# Altium schematic sheet FPGA Supply Pins.SchDoc
size A3; SheetNumber: 19; SheetTotal: 22
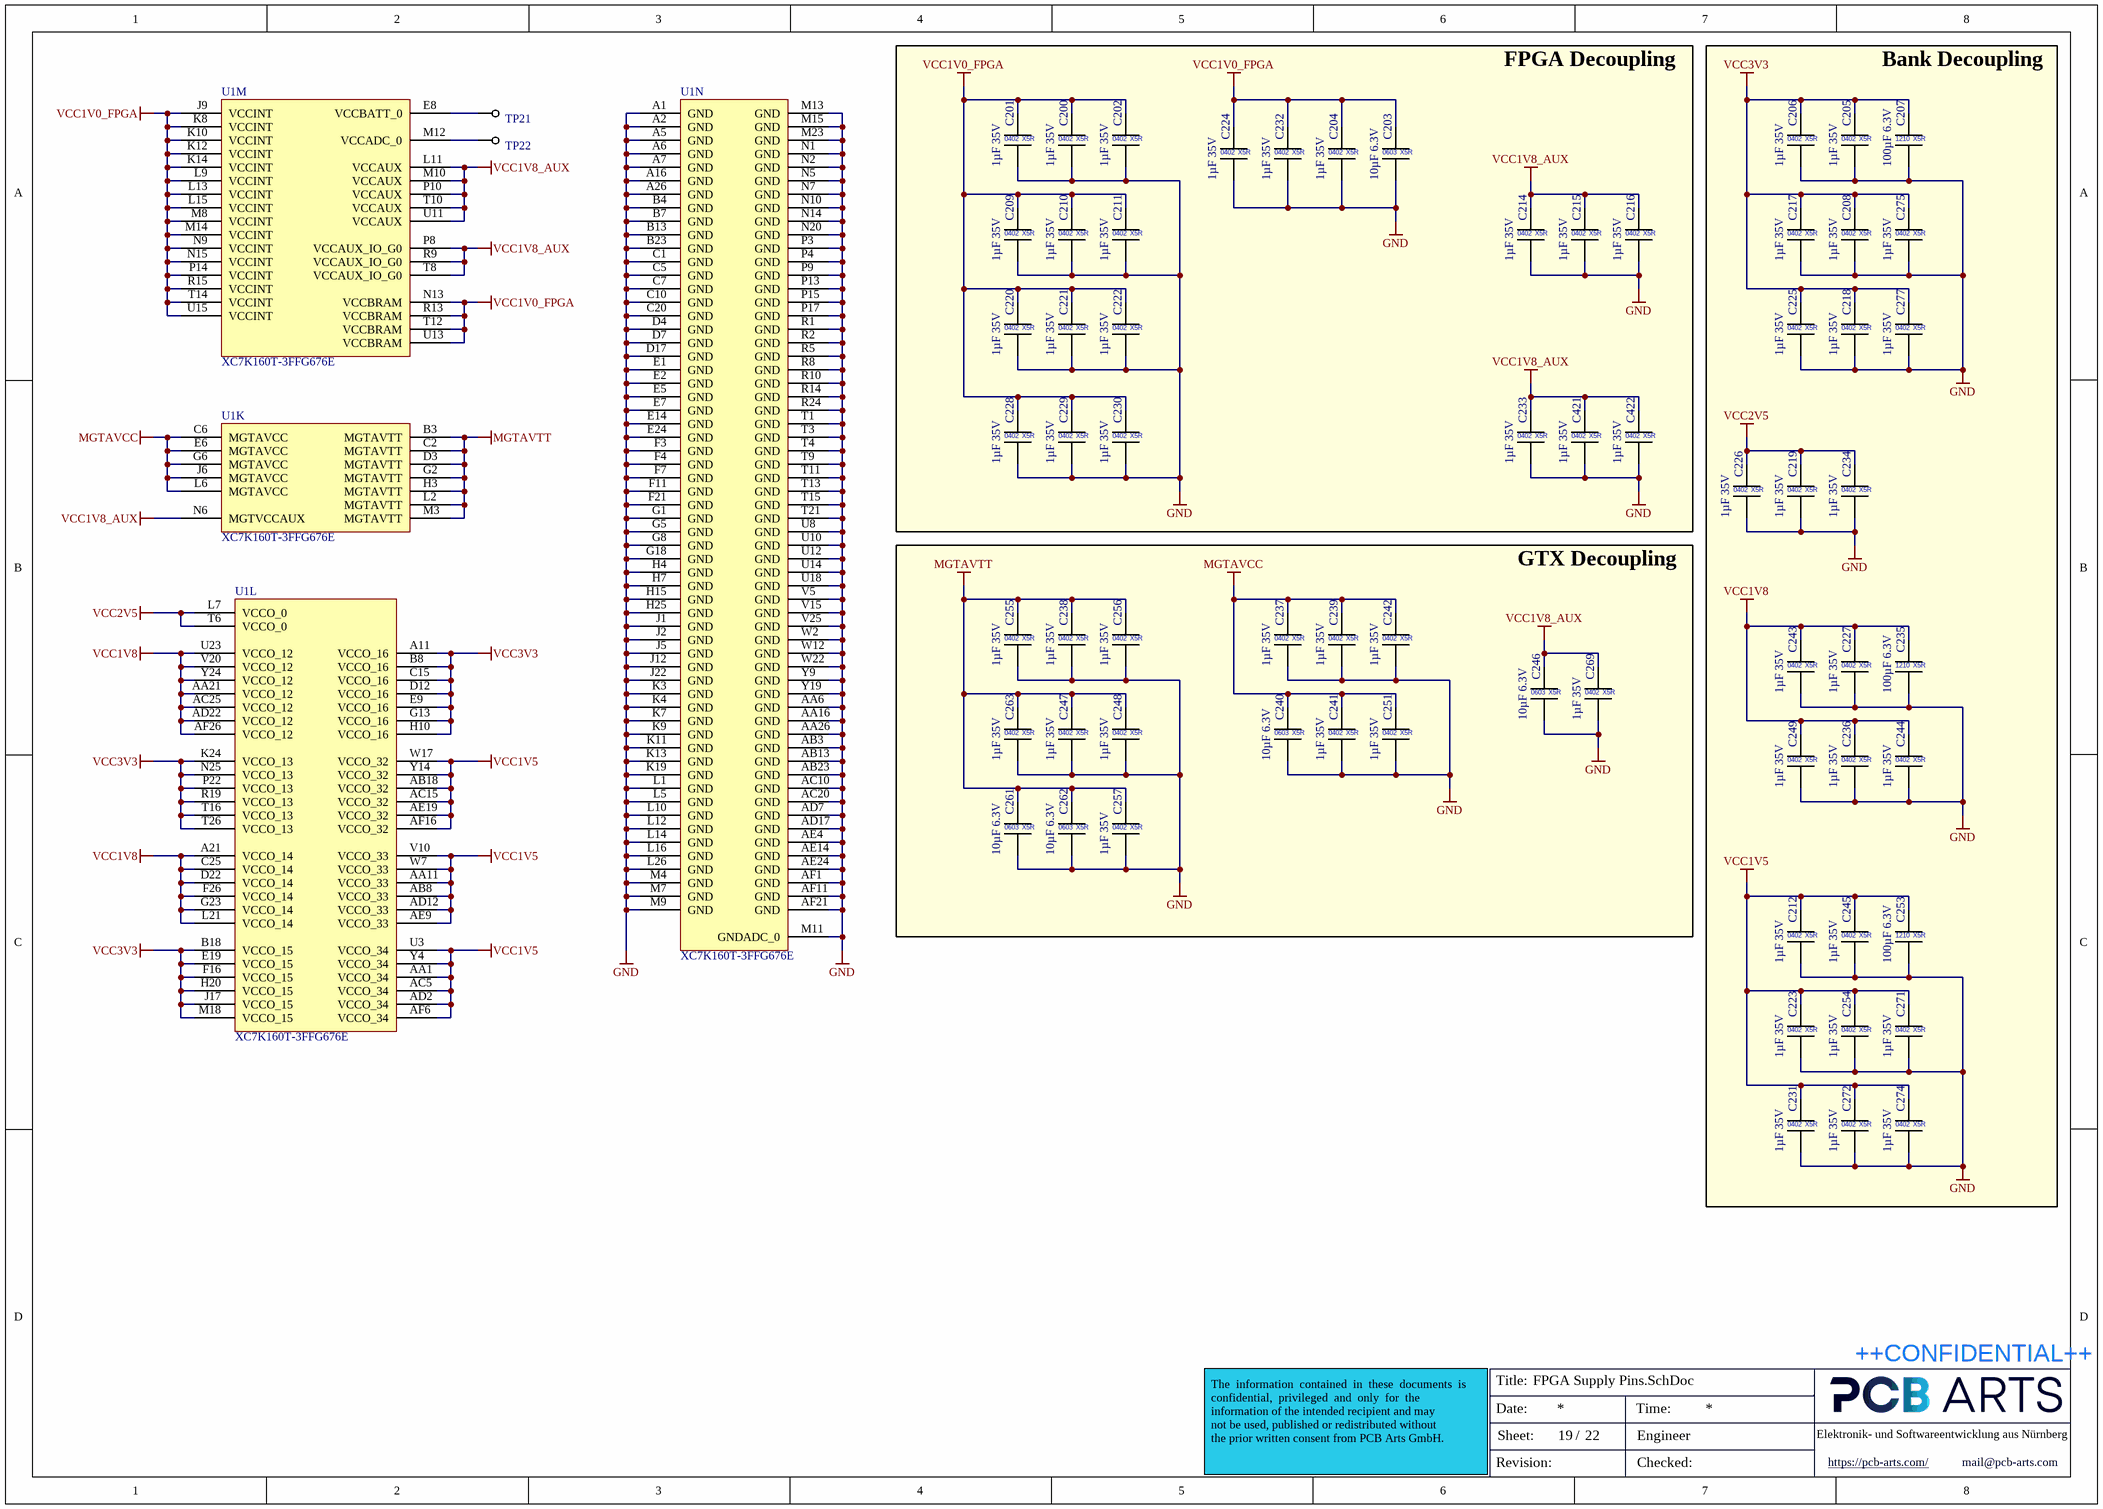
[diagram p0: FPGA Supply Pins.SchDoc]

## Parts
C200  1µF 35V  [CAP_0402_L]
C201  1µF 35V  [CAP_0402_L]
C202  1µF 35V  [CAP_0402_L]
C203  10µF 6.3V  [CAP_0603_L]
C204  1µF 35V  [CAP_0402_L]
C205  1µF 35V  [CAP_0402_L]
C206  1µF 35V  [CAP_0402_L]
C207  100µF 6.3V  [CAP_1210]
C208  1µF 35V  [CAP_0402_L]
C209  1µF 35V  [CAP_0402_L]
C210  1µF 35V  [CAP_0402_L]
C211  1µF 35V  [CAP_0402_L]
C212  1µF 35V  [CAP_0402_L]
C214  1µF 35V  [CAP_0402_L]
C215  1µF 35V  [CAP_0402_L]
C216  1µF 35V  [CAP_0402_L]
C217  1µF 35V  [CAP_0402_L]
C218  1µF 35V  [CAP_0402_L]
C219  1µF 35V  [CAP_0402_L]
C220  1µF 35V  [CAP_0402_L]
C221  1µF 35V  [CAP_0402_L]
C222  1µF 35V  [CAP_0402_L]
C223  1µF 35V  [CAP_0402_L]
C224  1µF 35V  [CAP_0402_L]
C225  1µF 35V  [CAP_0402_L]
C226  1µF 35V  [CAP_0402_L]
C227  1µF 35V  [CAP_0402_L]
C228  1µF 35V  [CAP_0402_L]
C229  1µF 35V  [CAP_0402_L]
C230  1µF 35V  [CAP_0402_L]
C231  1µF 35V  [CAP_0402_L]
C232  1µF 35V  [CAP_0402_L]
C233  1µF 35V  [CAP_0402_L]
C234  1µF 35V  [CAP_0402_L]
C235  100µF 6.3V  [CAP_1210]
C236  1µF 35V  [CAP_0402_L]
C237  1µF 35V  [CAP_0402_L]
C238  1µF 35V  [CAP_0402_L]
C239  1µF 35V  [CAP_0402_L]
C240  10µF 6.3V  [CAP_0603_L]
C241  1µF 35V  [CAP_0402_L]
C242  1µF 35V  [CAP_0402_L]
C243  1µF 35V  [CAP_0402_L]
C244  1µF 35V  [CAP_0402_L]
C245  1µF 35V  [CAP_0402_L]
C246  10µF 6.3V  [CAP_0603_L]
C247  1µF 35V  [CAP_0402_L]
C248  1µF 35V  [CAP_0402_L]
C249  1µF 35V  [CAP_0402_L]
C251  1µF 35V  [CAP_0402_L]
C253  100µF 6.3V  [CAP_1210]
C254  1µF 35V  [CAP_0402_L]
C255  1µF 35V  [CAP_0402_L]
C256  1µF 35V  [CAP_0402_L]
C257  1µF 35V  [CAP_0402_L]
C261  10µF 6.3V  [CAP_0603_L]
C262  10µF 6.3V  [CAP_0603_L]
C263  1µF 35V  [CAP_0402_L]
C269  1µF 35V  [CAP_0402_L]
C271  1µF 35V  [CAP_0402_L]
C272  1µF 35V  [CAP_0402_L]
C274  1µF 35V  [CAP_0402_L]
C275  1µF 35V  [CAP_0402_L]
C277  1µF 35V  [CAP_0402_L]
C421  1µF 35V  [CAP_0402_L]
C422  1µF 35V  [CAP_0402_L]
TP21  Testpoint  [Testpoint 0.8mm]  (value not drawn)  (no BOM)
TP22  Testpoint  [Testpoint 0.8mm]  (value not drawn)  (no BOM)
U1  XC7K160T-3FFG676E  [BGA100P2700X2700X317-676N]  (parts K,L,M,N of 14)

## Blocks framed on the sheet
FPGA Decoupling: C200-C204 C209-C211 C214-C216 C220-C222 C224 C228-C230 C232 C233 C421 C422
Bank Decoupling: C205-C208 C212 C217-C219 C223 C225-C227 C231 C234-C236 C243-C245 C249 C253 C254 C271 C272 C274 C275 C277
GTX Decoupling: C237-C242 C246-C248 C251 C255-C257 C261-C263 C269

## Nets
GND: C200.2 C201.2 C202.2 C203.2 C204.2 C205.2 C206.2 C207.2 C208.2 C209.2 C210.2 C211.2 C212.2 C214.2 C215.2 C216.2 C217.2 C218.2 C219.2 C220.2 C221.2 C222.2 C223.2 C224.2 C225.2 C226.2 C227.2 C228.2 C229.2 C230.2 C231.2 C232.2 C233.2 C234.2 C235.2 C236.2 C237.2 C238.2 C239.2 C240.2 C241.2 C242.2 C243.2 C244.2 C245.2 C246.2 C247.2 C248.2 C249.2 C251.2 C253.2 C254.2 C255.2 C256.2 C257.2 C261.2 C262.2 C263.2 C269.2 C271.2 C272.2 C274.2 C275.2 C277.2 C421.2 C422.2 U1.A1(GND) U1.A2(GND) U1.A5(GND) U1.A6(GND) U1.A7(GND) U1.A16(GND) U1.A26(GND) U1.AA6(GND) U1.AA16(GND) U1.AA26(GND) U1.AB3(GND) U1.AB13(GND) U1.AB23(GND) U1.AC10(GND) U1.AC20(GND) U1.AD7(GND) U1.AD17(GND) U1.AE4(GND) U1.AE14(GND) U1.AE24(GND) U1.AF1(GND) U1.AF11(GND) U1.AF21(GND) U1.B4(GND) U1.B7(GND) U1.B13(GND) U1.B23(GND) U1.C1(GND) U1.C5(GND) U1.C7(GND) U1.C10(GND) U1.C20(GND) U1.D4(GND) U1.D7(GND) U1.D17(GND) U1.E1(GND) U1.E2(GND) U1.E5(GND) U1.E7(GND) U1.E14(GND) U1.E24(GND) U1.F3(GND) U1.F4(GND) U1.F7(GND) U1.F11(GND) U1.F21(GND) U1.G1(GND) U1.G5(GND) U1.G8(GND) U1.G18(GND) U1.H4(GND) U1.H7(GND) U1.H15(GND) U1.H25(GND) U1.J1(GND) U1.J2(GND) U1.J5(GND) U1.J12(GND) U1.J22(GND) U1.K3(GND) U1.K4(GND) U1.K7(GND) U1.K9(GND) U1.K11(GND) U1.K13(GND) U1.K19(GND) U1.L1(GND) U1.L5(GND) U1.L10(GND) U1.L12(GND) U1.L14(GND) U1.L16(GND) U1.L26(GND) U1.M4(GND) U1.M7(GND) U1.M9(GND) U1.M11(GNDADC_0) U1.M13(GND) U1.M15(GND) U1.M23(GND) U1.N1(GND) U1.N2(GND) U1.N5(GND) U1.N7(GND) U1.N10(GND) U1.N14(GND) U1.N20(GND) U1.P3(GND) U1.P4(GND) U1.P9(GND) U1.P13(GND) U1.P15(GND) U1.P17(GND) U1.R1(GND) U1.R2(GND) U1.R5(GND) U1.R8(GND) U1.R10(GND) U1.R14(GND) U1.R24(GND) U1.T1(GND) U1.T3(GND) U1.T4(GND) U1.T9(GND) U1.T11(GND) U1.T13(GND) U1.T15(GND) U1.T21(GND) U1.U8(GND) U1.U10(GND) U1.U12(GND) U1.U14(GND) U1.U18(GND) U1.V5(GND) U1.V15(GND) U1.V25(GND) U1.W2(GND) U1.W12(GND) U1.W22(GND) U1.Y9(GND) U1.Y19(GND)
MGTAVCC: C237.1 C239.1 C240.1 C241.1 C242.1 C251.1 U1.C6(MGTAVCC) U1.E6(MGTAVCC) U1.G6(MGTAVCC) U1.J6(MGTAVCC) U1.L6(MGTAVCC)
MGTAVTT: C238.1 C247.1 C248.1 C255.1 C256.1 C257.1 C261.1 C262.1 C263.1 U1.B3(MGTAVTT) U1.C2(MGTAVTT) U1.D3(MGTAVTT) U1.G2(MGTAVTT) U1.H3(MGTAVTT) U1.L2(MGTAVTT) U1.M3(MGTAVTT)
VCC1V0_FPGA: C200.1 C201.1 C202.1 C203.1 C204.1 C209.1 C210.1 C211.1 C220.1 C221.1 C222.1 C224.1 C228.1 C229.1 C230.1 C232.1 U1.J9(VCCINT) U1.K8(VCCINT) U1.K10(VCCINT) U1.K12(VCCINT) U1.K14(VCCINT) U1.L9(VCCINT) U1.L13(VCCINT) U1.L15(VCCINT) U1.M8(VCCINT) U1.M14(VCCINT) U1.N9(VCCINT) U1.N13(VCCBRAM) U1.N15(VCCINT) U1.P14(VCCINT) U1.R13(VCCBRAM) U1.R15(VCCINT) U1.T12(VCCBRAM) U1.T14(VCCINT) U1.U13(VCCBRAM) U1.U15(VCCINT)
VCC1V5: C212.1 C223.1 C231.1 C245.1 C253.1 C254.1 C271.1 C272.1 C274.1 U1.AA1(VCCO_34) U1.AA11(VCCO_33) U1.AB8(VCCO_33) U1.AB18(VCCO_32) U1.AC5(VCCO_34) U1.AC15(VCCO_32) U1.AD2(VCCO_34) U1.AD12(VCCO_33) U1.AE9(VCCO_33) U1.AE19(VCCO_32) U1.AF6(VCCO_34) U1.AF16(VCCO_32) U1.U3(VCCO_34) U1.V10(VCCO_33) U1.W7(VCCO_33) U1.W17(VCCO_32) U1.Y4(VCCO_34) U1.Y14(VCCO_32)
VCC1V8: C227.1 C235.1 C236.1 C243.1 C244.1 C249.1 U1.A21(VCCO_14) U1.AA21(VCCO_12) U1.AC25(VCCO_12) U1.AD22(VCCO_12) U1.AF26(VCCO_12) U1.C25(VCCO_14) U1.D22(VCCO_14) U1.F26(VCCO_14) U1.G23(VCCO_14) U1.L21(VCCO_14) U1.U23(VCCO_12) U1.V20(VCCO_12) U1.Y24(VCCO_12)
VCC1V8_AUX: C214.1 C215.1 C216.1 C233.1 C246.1 C269.1 C421.1 C422.1 U1.L11(VCCAUX) U1.M10(VCCAUX) U1.N6(MGTVCCAUX) U1.P8(VCCAUX_IO_G0) U1.P10(VCCAUX) U1.R9(VCCAUX_IO_G0) U1.T8(VCCAUX_IO_G0) U1.T10(VCCAUX) U1.U11(VCCAUX)
VCC2V5: C219.1 C226.1 C234.1 U1.L7(VCCO_0) U1.T6(VCCO_0)
VCC3V3: C205.1 C206.1 C207.1 C208.1 C217.1 C218.1 C225.1 C275.1 C277.1 U1.A11(VCCO_16) U1.B8(VCCO_16) U1.B18(VCCO_15) U1.C15(VCCO_16) U1.D12(VCCO_16) U1.E9(VCCO_16) U1.E19(VCCO_15) U1.F16(VCCO_15) U1.G13(VCCO_16) U1.H10(VCCO_16) U1.H20(VCCO_15) U1.J17(VCCO_15) U1.K24(VCCO_13) U1.M18(VCCO_15) U1.N25(VCCO_13) U1.P22(VCCO_13) U1.R19(VCCO_13) U1.T16(VCCO_13) U1.T26(VCCO_13)
NetTP21_1: TP21.1(GND) U1.E8(VCCBATT_0)
NetTP22_1: TP22.1(GND) U1.M12(VCCADC_0)

## Notes on the sheet
- Title:
- ++CONFIDENTIAL++
- Date:
- Sheet:
- /
- Time:
- Engineer
- Elektronik- und Softwareentwicklung aus Nürnberg
- The  information  contained  in  these  documents  is  confidential,  privileged  and  only  for  the
  information of the intended recipient and may
  not be used, published or redistributed without
  the prior written consent from PCB Arts GmbH.
- Revision:
- Checked:
- https://pcb-arts.com/
- mail@pcb-arts.com
- (in symbol CAP_0402_1µF_35V) 0402; X5R
- (in symbol CAP_0603_10µF_6.3V) 0603; X5R
- (in symbol CAP_1210_100µF_6.3V) 1210; X5R

## Library data of the parts
C200-C202 C204-C206 C208-C212 C214-C234 C236-C239 C241-C245 C247-C249 C251 C254-C257 C263 C269 C271 C272 C274 C275 C277 C421 C422 = CAP_0402_1µF_35V: Multilayer Ceramic Capacitors MLCC - SMD/SMT 0402 35VDC; Manufacturer 1: Kyocera Electronic Components; Manufacturer 1 Prt. Nr.: CM05X5R105K35AH; Manufacturer 2 Prt. Nr.: C1005X5R1V105K050BC; Manufacturer 2: TDK
C203 C240 C246 C261 C262 = CAP_0603_10µF_6.3V: Multilayer Ceramic Capacitors MLCC - SMD/SMT 0603 6.3VDC; Manufacturer 1: Murata Electronics; Manufacturer 1 Prt. Nr.: GRM188R60J106ME84J; Manufacturer 2 Prt. Nr.: JMK107ABJ106MA-T; Manufacturer 2: Taiyo Yuden
C207 C235 C253 = CAP_1210_100µF_6.3V: Multilayer Ceramic Capacitors MLCC - SMD/SMT 1210 6.3VDC; Manufacturer 1: Samsung Electro-Mechanics; Manufacturer 1 Prt. Nr.: CL32A107MQVNNWE; Manufacturer 2 Prt. Nr.: JMK325ABJ107MMHP; Manufacturer 2: Taiyo Yuden
TP21 TP22 = Testpoint 0.8mm
U1 = XC7K160T-3FFG676E_Kintex-7 FPGA, 400 User I/Os, 8 GTX, FFG676: Kintex-7 FPGA, 400 User I/Os, 8 GTX, 676-Ball BGA, Speed Grade 3, Extended Grade, Pb-Free; Manufacturer 1: Xilinx; Manufacturer 1 Prt. Nr.: XC7K160T-3FFG676E; ComponentLink1URL: http://www.xilinx.com/support/documentation/data_sheets/ds180_7Series_Overview.pdf; ComponentLink2URL: http://www.xilinx.com/support/documentation/user_guides/ug865-Zynq-7000-Pkg-Pinout.pdf; ComponentLink1Description: Datasheet; ComponentLink2Description: Package Specification